# EAGLE schematic ai_breakout_mics5524_panel (EAGLE 6.6.0)
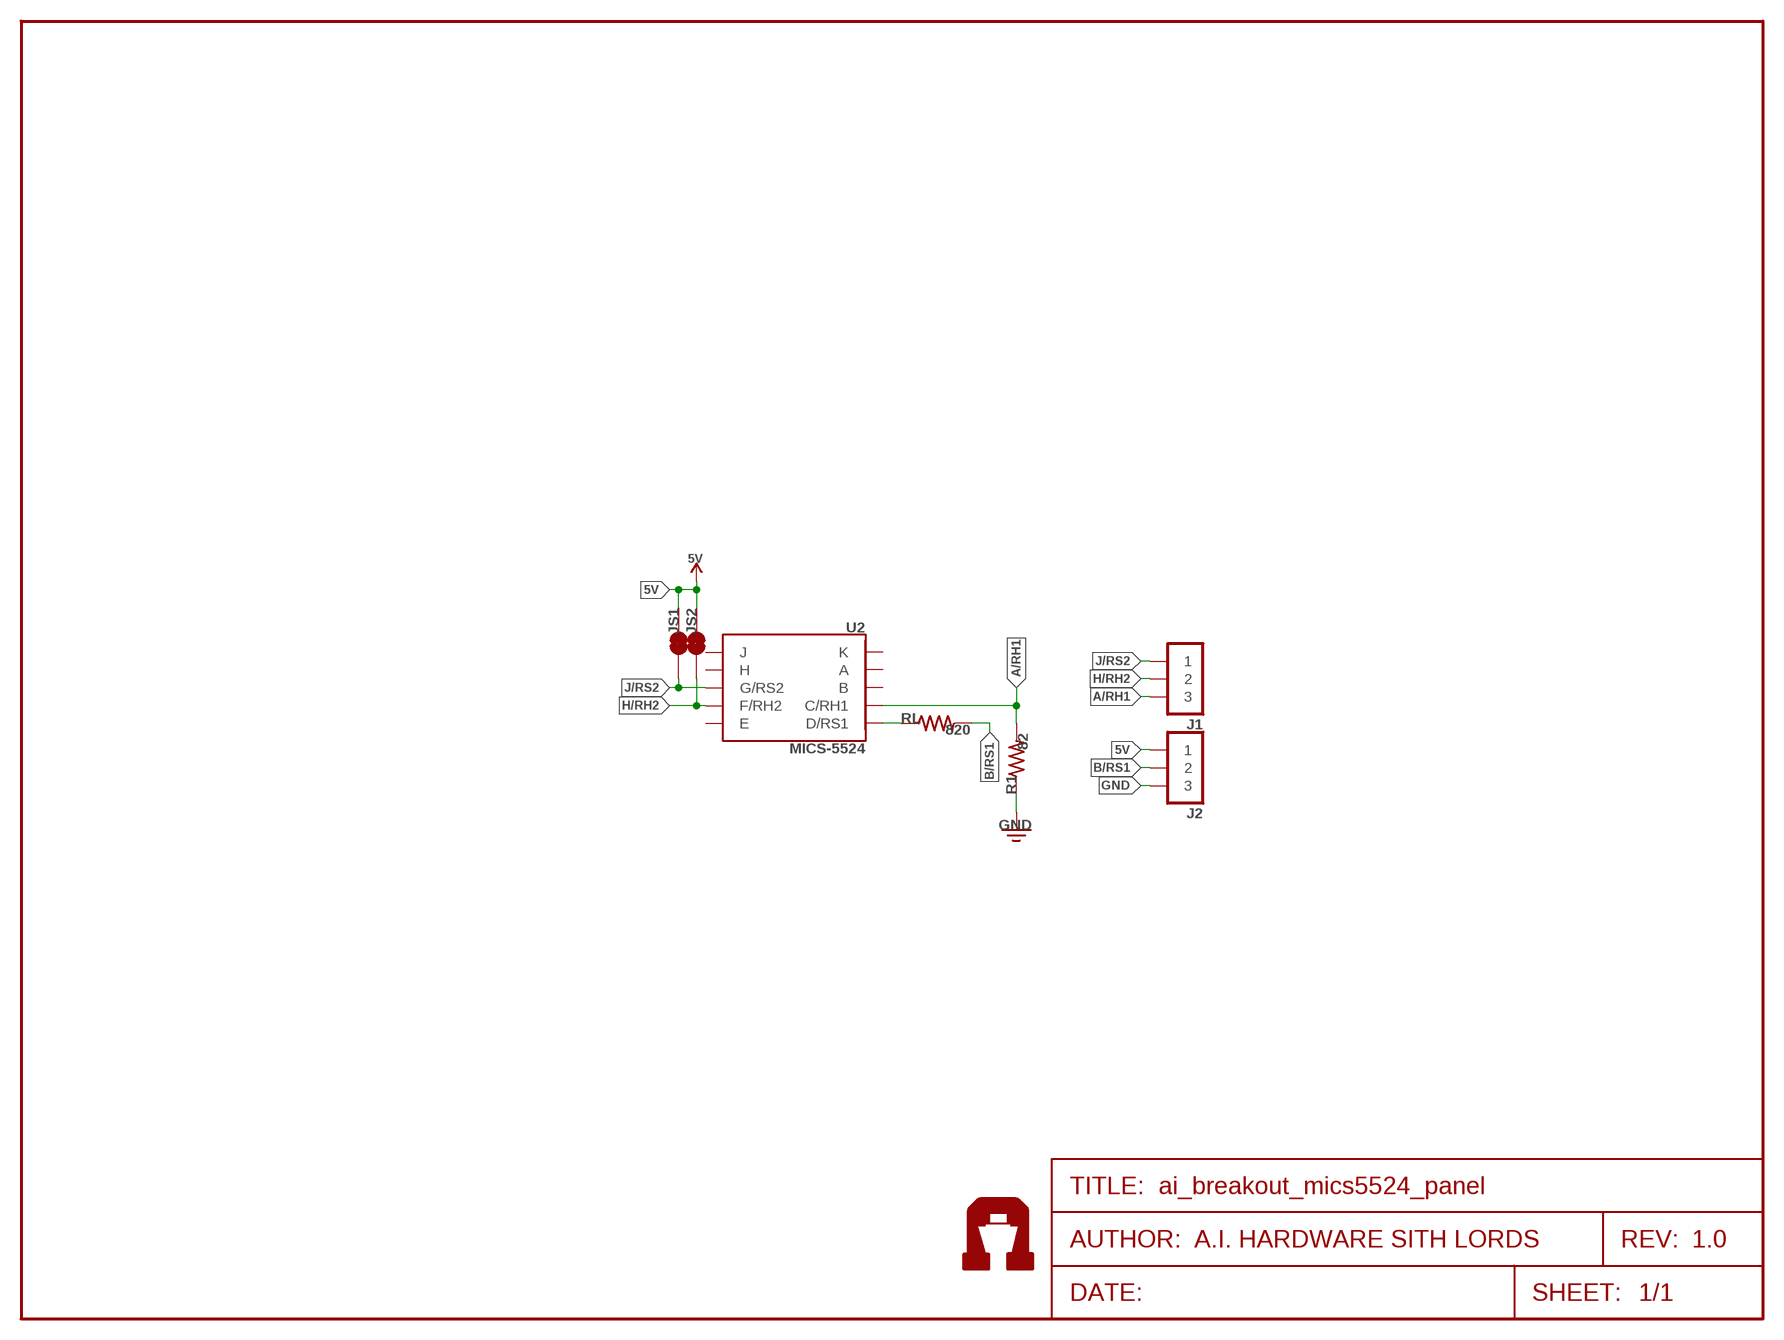
[diagram p0: schematic, sheet 1]
FRAME1 (FRAME-LETTER): AUTHOR: A.I. HARDWARE SITH LORDS; REV: 1.0

## Parts
J1  1X03NOFIRST  [1X03-NOFIRST]
J2  1X03NOFIRST  [1X03-NOFIRST]
JS1  1X02-SJ-NCT  [1X02-SJ-NCT]
JS2  1X02-SJ-NCT  [1X02-SJ-NCT]
R1  82  RES0603  [RES-0603]
RL  820  RES0603  [RES-0603]
U2  MICS-5524  [MICS-SMD10]
U$3  AI-LOGOXS  [AI-LOGO-XS]

## Nets
5V [power]: J2.1 JS1.2 JS2.2
A/RH1: J1.3 R1.2 U2.C(C/RH1)
B/RS1: J2.2 RL.2
GND [power]: J2.3 R1.1
H/RH2: J1.2 JS2.1 U2.F(F/RH2)
J/RS2: J1.1 JS1.1 U2.G(G/RS2)
N$1: RL.1 U2.D(D/RS1)
Unconnected: U2.A U2.B U2.E U2.H U2.J U2.K

## Library data of the parts
J1 J2 = Ai_Connectors:1X03
JS1 JS2 = Ai_Connectors:1X02-SJ-NC: Solder Jumper Normally closed versions.
R1 RL = Ai_Passives:RES: Part # blah Digikey
U2 = Ai_IC:MICS-5524
U$3 = Ai_Miscellany:AI-LOGO

## Net classes
0 signal: width 0.254 mm
1 power: width 0.305 mm